# EAGLE schematic adb (EAGLE 9.6.1)
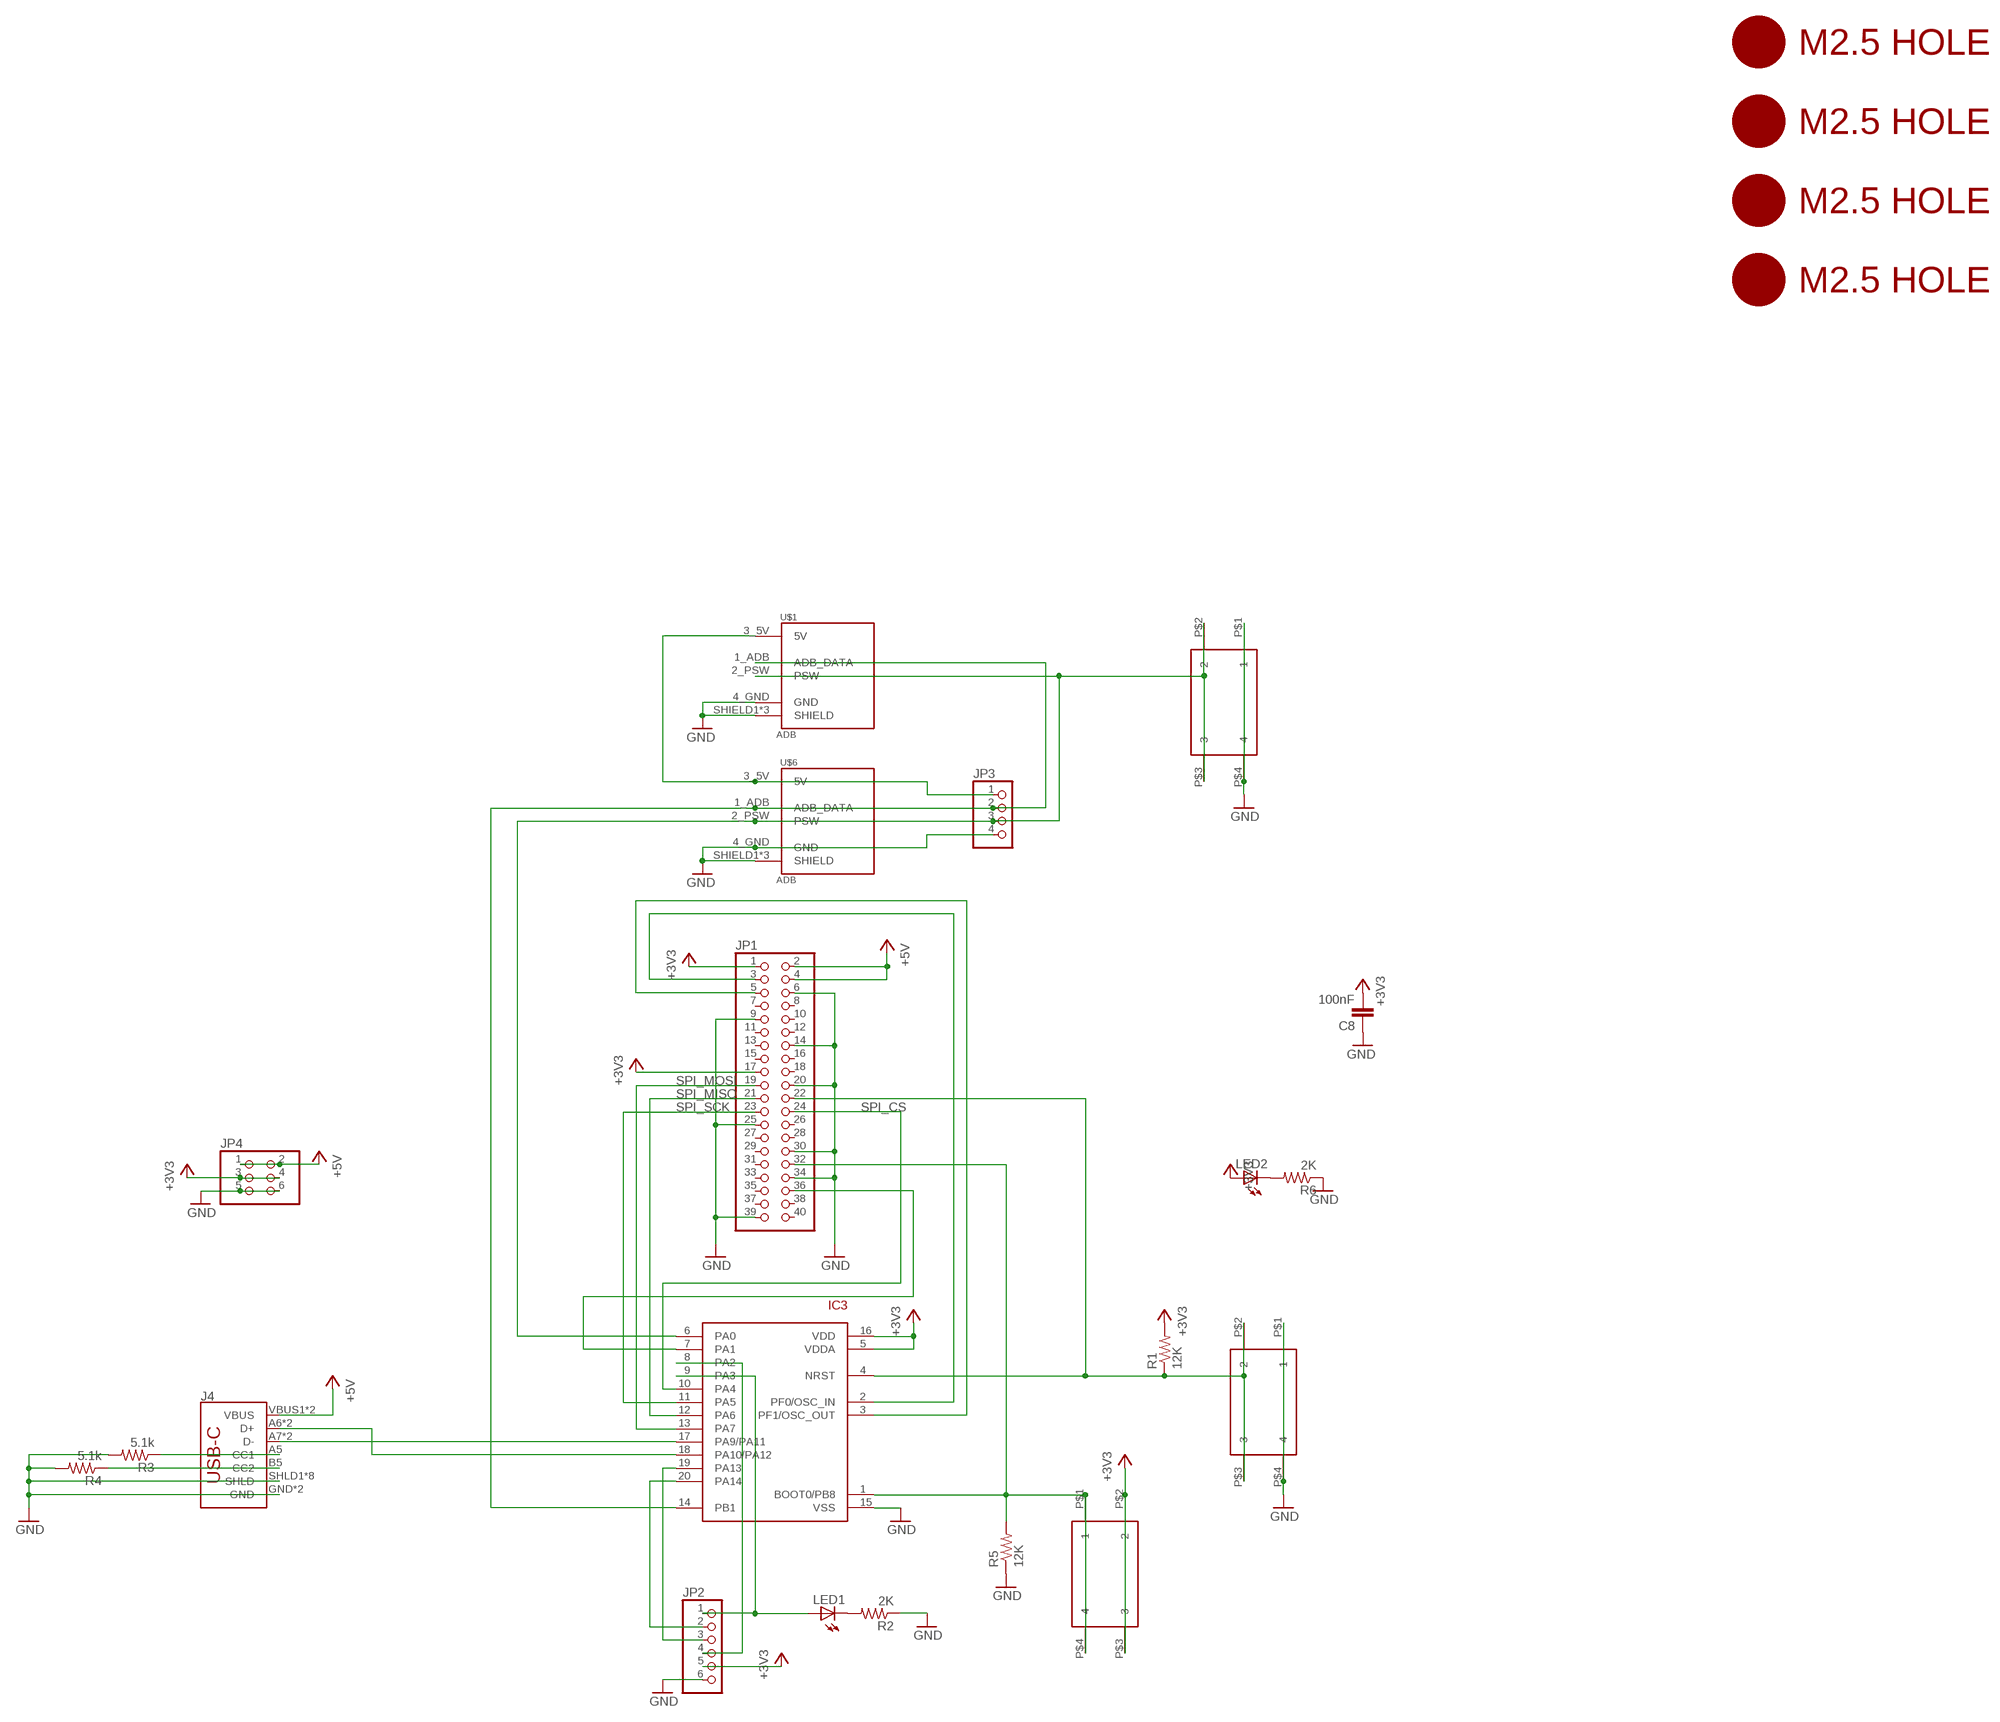
[diagram p0: schematic, sheet 1]

## Parts
C8  100nF  CAP0805  [0805@1]
IC3  STM32F042F4  [TSSOP20]
J4  USB_C16PIN  [USB-C-16P]
JP1  PINHD-2X20-BIG  [2X20-BIG]
JP2  PINHD-1X6  [1X06]
JP3  PINHD-1X4  [1X04]
JP4  PINHD-2X3  [2X03]
LED1  LEDCHIP-LED0805  [CHIP-LED0805]
LED2  LEDCHIP-LED0805  [CHIP-LED0805]
R1  12K  RESISTOR0805-RES  [0805]
R2  2K  RESISTOR0805-RES  [0805]
R3  5.1k  RESISTOR0805-RES  [0805]
R4  5.1k  RESISTOR0805-RES  [0805]
R5  12K  RESISTOR0805-RES  [0805]
R6  2K  RESISTOR0805-RES  [0805]
SW1  324_SW  [342_SWICH_FOOT]
SW2  324_SW  [342_SWICH_FOOT]
SW4  324_SW  [342_SWICH_FOOT]
U$1  ADB  [DIN4]
U$2  M2.5HOLE  [M2.5HOLE]
U$3  M2.5HOLE  [M2.5HOLE]
U$4  M2.5HOLE  [M2.5HOLE]
U$5  M2.5HOLE  [M2.5HOLE]
U$6  ADB  [DIN4]

## Nets
+3V3: C8.2 IC3.5(VDDA) IC3.16(VDD) JP1.1 JP1.17 JP2.5 JP4.3 JP4.4 LED2.A R1.2 SW1.P$2 SW1.P$3
+5V: J4.VBUS1(VBUS) J4.VBUS2(VBUS) JP1.2 JP1.4 JP4.1 JP4.2
GND: C8.1 IC3.15(VSS) J4.GND J4.GND2(GND) J4.SHLD1(SHLD) J4.SHLD2(SHLD) J4.SHLD3(SHLD) J4.SHLD4(SHLD) J4.SHLD5(SHLD) J4.SHLD6(SHLD) J4.SHLD7(SHLD) J4.SHLD8(SHLD) JP1.6 JP1.9 JP1.14 JP1.20 JP1.25 JP1.30 JP1.34 JP1.39 JP2.6 JP3.4 JP4.5 JP4.6 R2.1 R3.2 R4.2 R5.1 R6.1 SW2.P$1 SW2.P$4 SW4.P$1 SW4.P$4 U$1.4_GND(GND) U$1.SHIELD1(SHIELD) U$1.SHIELD2(SHIELD) U$1.SHIELD3(SHIELD) U$6.4_GND(GND) U$6.SHIELD1(SHIELD) U$6.SHIELD2(SHIELD) U$6.SHIELD3(SHIELD)
N$1: J4.A5(CC1) R3.1
N$2: IC3.1(BOOT0/PB8) JP1.32 R5.2 SW1.P$1 SW1.P$4
N$3: IC3.18(PA10/PA12) J4.A6(D+) J4.B6(D+)
N$4: IC3.17(PA9/PA11) J4.A7(D-) J4.B7(D-)
N$5: IC3.8(PA2) JP2.4
N$6: IC3.19(PA13) JP2.3
N$7: J4.B5(CC2) R4.1
N$8: IC3.20(PA14) JP2.2
N$9: IC3.9(PA3) JP2.1 LED1.A
N$10: IC3.2(PF0/OSC_IN) JP1.3
N$11: IC3.3(PF1/OSC_OUT) JP1.5
N$12: IC3.7(PA1) JP1.36
N$13: IC3.4(NRST) JP1.22 R1.1 SW4.P$2 SW4.P$3
N$14: JP3.1 U$1.3_5V(5V) U$6.3_5V(5V)
N$15: IC3.14(PB1) JP3.2 U$1.1_ADB(ADB_DATA) U$6.1_ADB(ADB_DATA)
N$17: LED1.C R2.2
N$18: IC3.6(PA0) JP3.3 SW2.P$2 SW2.P$3 U$1.2_PSW(PSW) U$6.2_PSW(PSW)
N$29: LED2.C R6.2
SPI_CS: IC3.10(PA4) JP1.24
SPI_MISO: IC3.12(PA6) JP1.21
SPI_MOSI: IC3.13(PA7) JP1.19
SPI_SCK: IC3.11(PA5) JP1.23
Unconnected: JP1.7 JP1.8 JP1.10 JP1.11 JP1.12 JP1.13 JP1.15 JP1.16 JP1.18 JP1.26 JP1.27 JP1.28 JP1.29 JP1.31 JP1.33 JP1.35 JP1.37 JP1.38 JP1.40

## Library data of the parts
C8 = clock:CAP: Capacitor Standard 0603 ceramic capacitor, and 0.1" leaded capacitor.
IC3 = tx:STM32F042F4
J4 = SparkFun-Connectors:USB_C: USB Type C 16Pin Connector Super Speed pins not available on the 16-pin purely SMD connector so this part is best for USB 2.0 implementations. D1 and D2 are tied together enabling D+/- no matter which way the cable is plugged into the connector. The two channel configuration pins (CC1/2) are exposed. These are normally connected to ground via 5.1k resistors but can be reconfigured for high current/high power applications.; PROD_ID: CONN-14122
JP1 = adafruit_changed:PINHD-2X20: PIN HEADER
JP2 = pinhead:PINHD-1X6: PIN HEADER
JP3 = pinhead:PINHD-1X4: PIN HEADER
JP4 = pinhead:PINHD-2X3: PIN HEADER
LED1 LED2 = adafruit:LED: LED OSRAM: - CHIPLED LG R971, LG N971, LY N971, LG Q971, LY Q971, LO R971, LY R971 LH N974, LH R974 LS Q976, LO Q976, LY Q976 LO Q996 - Hyper CHIPLED LW Q18S LB Q993, LB Q99A, LB R99A - SideLED LS A670, LO A670, LY A670, LG A670, LP A670 LB A673, LV A673, LT A673, LW A673 LH A674 LY A675 LS A676, LA A676, LO A676, LY A676, LW A676 LS A679, LY A679, LG A679 - Hyper Micro SIDELED® LS Y876, LA Y876, LO Y876, LY Y876 LT Y87S - SmartLED LW L88C, LW L88S LB L89C, LB L89S, LG L890 LS L89K, LO L89K, LY L89K LS L896, LA L896, LO L896, LY L896 - TOPLED LS T670, LO T670, LY T670, LG T670, LP T670 LSG T670, LSP T670, LSY T670, LOP T670, LYG T670 LG T671, LOG T671, LSG T671 LB T673, LV T673, LT T673, LW T673 LH T674 LS T676, LA T676, LO T676, LY T676, LB T676, LH T676, LSB T676, LW T676 LB T67C, LV T67C, LT T67C, LS T67K, LO T67K, LY T67K, LW E67C LS E67B, LA E67B, LO E67B, LY E67B, LB E67C, LV E67C, LT E67C LW T67C LS T679, LY T679, LG T679 LS T770, LO T770, LY T770, LG T770, LP T770 LB T773, LV T773, LT T773, LW T773 LH T774 LS E675, LA E675, LY E675, LS T675 LS T776, LA T776, LO T776, LY T776, LB T776 LHGB T686 LT T68C, LB T68C - Hyper Mini TOPLED® LB M676 - Mini TOPLED Santana® LG M470 LS M47K, LO M47K, LY M47K Source: http://www.osram.convergy.de/
R1-R6 = SparkFun-Passives:RESISTOR: Resistor Basic schematic elements and footprints for 0603, 1206, and PTH resistors.
SW1 SW2 SW4 = 3pos_slide_switch_centered:324_SW
U$1 U$6 = adb:ADB
U$2-U$5 = f1c100s:M2.5HOLE

## Net classes
1 power: width 0.178 mm